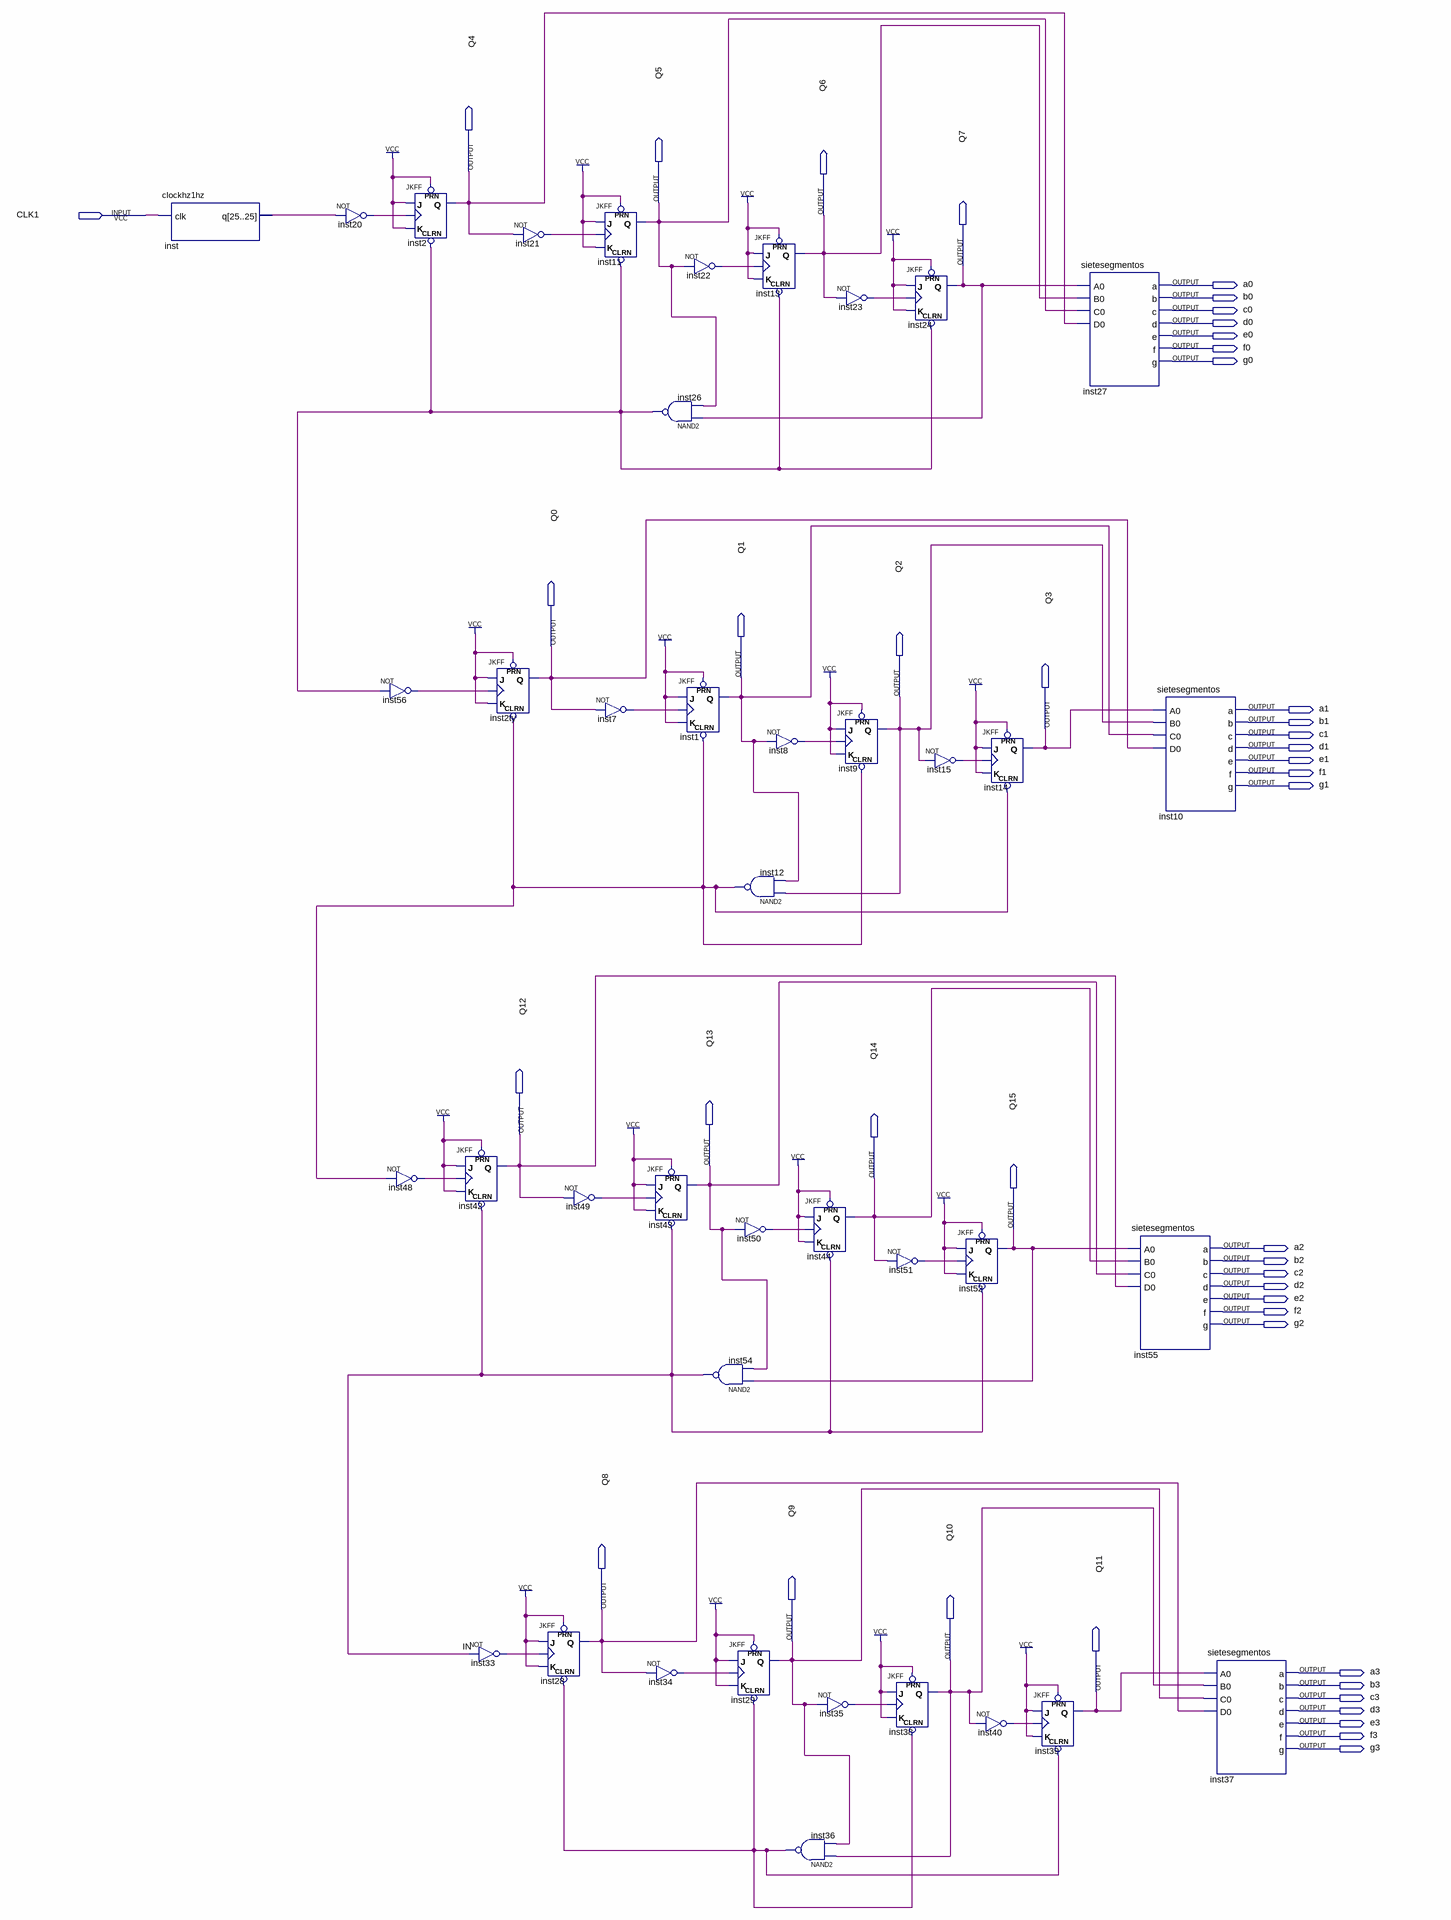
[diagram p0: schematic sheet]
// Quartus schematic RLC.bdf as structural Verilog: 41 symbols, 45 pins
module RLC (
  input  CLK1,
  output Q4,
  output Q5,
  output Q6,
  output Q7,
  output a0,
  output b0,
  output c0,
  output d0,
  output e0,
  output f0,
  output g0,
  output Q0,
  output Q1,
  output Q2,
  output a1,
  output b1,
  output Q3,
  output c1,
  output d1,
  output e1,
  output f1,
  output g1,
  output Q12,
  output Q13,
  output Q14,
  output Q15,
  output a2,
  output b2,
  output c2,
  output d2,
  output e2,
  output f2,
  output g2,
  output Q8,
  output Q9,
  output Q10,
  output a3,
  output b3,
  output Q11,
  output c3,
  output d3,
  output e3,
  output f3,
  output g3
);

  wire IN, inst7_out, inst8_out, inst12_out, inst15_out, inst20_out, inst21_out, inst22_out, inst23_out,
       inst26_out, inst33_out, inst34_out, inst35_out, inst36_out, inst40_out, inst48_out, inst49_out,
       inst50_out, inst51_out, inst56_out, inst_q;

  clockhz1hz inst (.clk(CLK1), .q(inst_q));
  not inst20 (inst20_out, inst_q);
  not inst56 (inst56_out, inst26_out);
  not inst48 (inst48_out, inst12_out);
  JKFF inst2 (.PRN(1'b1), .CLRN(inst26_out), .K(1'b1), .J(1'b1), .CLK(inst20_out), .Q(Q4));
  JKFF inst2ty (.PRN(1'b1), .CLRN(inst12_out), .K(1'b1), .J(1'b1), .CLK(inst56_out), .Q(Q0));
  JKFF inst42 (.PRN(1'b1), .CLRN(IN), .K(1'b1), .J(1'b1), .CLK(inst48_out), .Q(Q12));
  not inst33 (inst33_out, IN);
  not inst21 (inst21_out, Q4);
  JKFF inst28 (.PRN(1'b1), .CLRN(inst36_out), .K(1'b1), .J(1'b1), .CLK(inst33_out), .Q(Q8));
  JKFF inst11 (.PRN(1'b1), .CLRN(inst26_out), .K(1'b1), .J(1'b1), .CLK(inst21_out), .Q(Q5));
  not inst7 (inst7_out, Q0);
  not inst49 (inst49_out, Q12);
  nand inst26 (inst26_out, Q7, Q5);
  JKFF inst43 (.PRN(1'b1), .CLRN(IN), .K(1'b1), .J(1'b1), .CLK(inst49_out), .Q(Q13));
  not inst34 (inst34_out, Q8);
  not inst22 (inst22_out, Q5);
  JKFF inst1 (.PRN(1'b1), .CLRN(inst12_out), .K(1'b1), .J(1'b1), .CLK(inst7_out), .Q(Q1));
  nand inst54 (IN, Q15, Q13);
  JKFF inst13 (.PRN(1'b1), .CLRN(inst26_out), .K(1'b1), .J(1'b1), .CLK(inst22_out), .Q(Q6));
  nand inst12 (inst12_out, Q2, Q1);
  not inst50 (inst50_out, Q13);
  JKFF inst29 (.PRN(1'b1), .CLRN(inst36_out), .K(1'b1), .J(1'b1), .CLK(inst34_out), .Q(Q9));
  not inst8 (inst8_out, Q1);
  JKFF inst44 (.PRN(1'b1), .CLRN(IN), .K(1'b1), .J(1'b1), .CLK(inst50_out), .Q(Q14));
  nand inst36 (inst36_out, Q10, Q9);
  not inst23 (inst23_out, Q6);
  JKFF inst9 (.PRN(1'b1), .CLRN(inst12_out), .K(1'b1), .J(1'b1), .CLK(inst8_out), .Q(Q2));
  not inst35 (inst35_out, Q9);
  JKFF inst24 (.PRN(1'b1), .CLRN(inst26_out), .K(1'b1), .J(1'b1), .CLK(inst23_out), .Q(Q7));
  not inst51 (inst51_out, Q14);
  JKFF inst38 (.PRN(1'b1), .CLRN(inst36_out), .K(1'b1), .J(1'b1), .CLK(inst35_out), .Q(Q10));
  not inst15 (inst15_out, Q2);
  JKFF inst52 (.PRN(1'b1), .CLRN(IN), .K(1'b1), .J(1'b1), .CLK(inst51_out), .Q(Q15));
  JKFF inst14 (.PRN(1'b1), .CLRN(inst12_out), .K(1'b1), .J(1'b1), .CLK(inst15_out), .Q(Q3));
  not inst40 (inst40_out, Q10);
  JKFF inst39 (.PRN(1'b1), .CLRN(inst36_out), .K(1'b1), .J(1'b1), .CLK(inst40_out), .Q(Q11));
  sietesegmentos inst27 (.A0(Q7), .B0(Q6), .C0(Q5), .D0(Q4), .a(a0), .b(b0), .c(c0), .d(d0), .e(e0), .f(f0), .g(g0));
  sietesegmentos inst10 (.A0(Q3), .B0(Q2), .C0(Q1), .D0(Q0), .a(a1), .b(b1), .c(c1), .d(d1), .e(e1), .f(f1), .g(g1));
  sietesegmentos inst55 (
    .A0(Q15), .B0(Q14), .C0(Q13), .D0(Q12), .a(a2), .b(b2), .c(c2), .d(d2), .e(e2), .f(f2), .g(g2));
  sietesegmentos inst37 (.A0(Q11), .B0(Q10), .C0(Q9), .D0(Q8), .a(a3), .b(b3), .c(c3), .d(d3), .e(e3), .f(f3), .g(g3));
endmodule
